# EAGLE design NGIMU Serial Breakout (EAGLE 7.5.0)
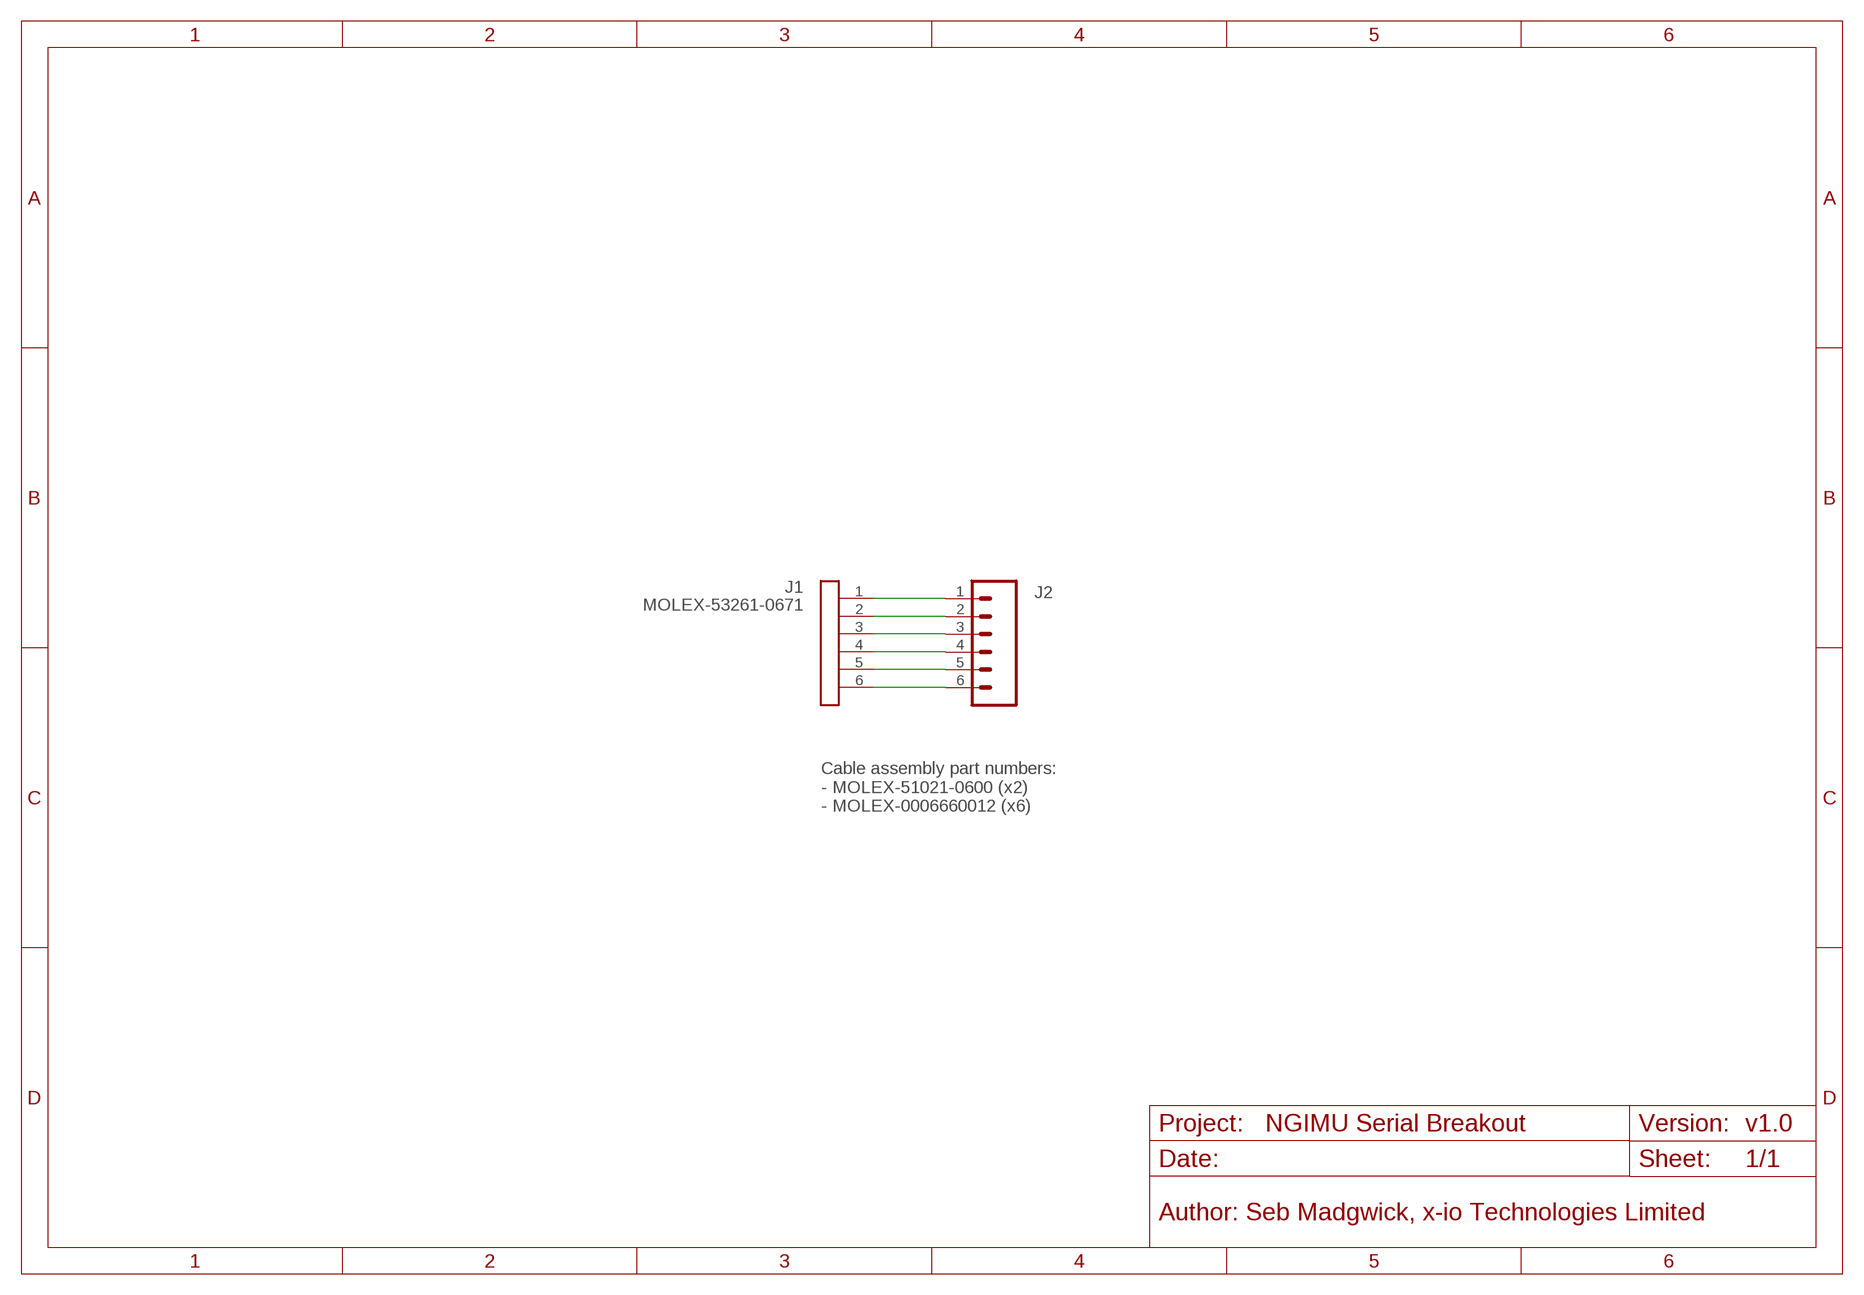
[diagram p0: schematic, sheet 1]

## Parts
J1  MOLEX-53261-0671  [MOLEX-53261-0671]
J2  M06NO_SILK_FEMALE_PTH  [1X06_NO_SILK]

## Nets
N$1: J1.6 J2.6
N$2: J1.5 J2.5
N$3: J1.4 J2.4
N$4: J1.3 J2.3
N$5: J1.2 J2.2
N$6: J1.1 J2.1

## Notes on the sheet
- Cable assembly part numbers:
  - MOLEX-51021-0600 (x2)
  - MOLEX-0006660012 (x6)
- v1.0
- Author: Seb Madgwick, x-io Technologies Limited

## Library data of the parts
J1 = x-io:MOLEX-53261-0671
J2 = SparkFun-Connectors:M06: Header 6 Standard 6-pin 0.1" header. Use with straight break away headers (SKU : PRT-00116), right angle break away headers (PRT-00553), swiss pins (PRT-00743), machine pins (PRT-00117), and female headers (PRT-00115). Molex polarized connector foot print use with SKU : PRT-08094 with associated crimp pins and housings. NOTES ON THE VARIANTS LOCK and LOCK_LONGPADS... This footprint was designed to help hold the alignment of a through-hole component (i.e. 6-pin header) while soldering it into place. You may notice that each hole has been shifted either up or down by 0.005 of an inch from it's more standard position (which is a perfectly straight line). This slight alteration caused the pins (the squares in the middle) to touch the edges of the holes. Because they are alternating, it causes a "brace" to hold the component in place. 0.005 has proven to be the perfect amount of "off-center" position when using our standard breakaway headers. Although looks a little odd when you look at the bare footprint, once you have a header in there, the alteration is very hard to notice. Also,if you push a header all the way into place, it is covered up entirely on the bottom side. This idea of altering the position of holes to aid alignment will be further integrated into the Sparkfun Library for other footprints. It can help hold any component with 3 or more connection pins.; PROD_ID: CONN-08437

## Board
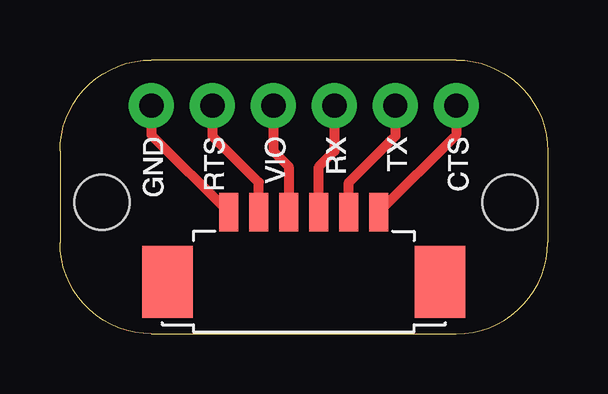
[diagram p1: board, top side]

Size 20.32 x 11.43 mm. Coordinates in mm from the lower left corner, seen from the top.
Outline: 3.81,0 16.51,0 arc90 20.32,3.81 20.32,7.62 arc90 16.51,11.43 3.81,11.43 arc90 0,7.62 0,3.81 arc90 3.81,0
Copper layers (1*16): Top 0.035mm / dielectric 1.5mm / Bottom 0.035mm
Design rules "default *": minimum track width 6mil, minimum drill 13mil, track to track 6mil, track to pad 6mil, pad to pad 6mil, via to via 6mil, smd to smd 6mil, copper to edge 15mil, drill to drill 13mil, minimum pad ring 10mil, minimum via ring 8mil, stop-mask expansion 4mil, vias tented up to drill 0mil, thermal gap 10mil
Holes 2.3 mm at 18.75,5.5 1.75,5.5

### Footprints (pad centres in the part's own frame; a part is rotated, then mirrored left to right if it is on the bottom)
MOLEX-53261-0671 = smd 0.8 x 1.6: 1 -3.125,0; 2 -1.875,0; 3 -0.625,0; 4 0.625,0; 5 1.875,0; 6 3.125,0 | smd 2.1 x 3: FITTING_NAIL1 -5.675,-2.9; FITTING_NAIL2 5.675,-2.9
1X06_NO_SILK = drill 1.016 pad 1.88: 1 0,0; 2 2.54,0; 3 5.08,0; 4 7.62,0; 5 10.16,0; 6 12.7,0

### Placement (x,y rotation side)
J1  10.16,5.08 0 top
J2  3.81,9.53 0 top
U$1  [NGIMU_SERIAL_BREAKOUT_V1.0_BOTTOM]  0,0 0 top
U$2  [NGIMU_SERIAL_BREAKOUT_V1.0_TOP]  0,0 0 top

### Tracks (layer width: path | path; a pad name or v marks a point on that pad's centre or on a via)
N$1
  Top 0.406: J2.6 16.51,8.3 J1.6
N$2
  Top 0.406: J2.5 13.97,8.26 12.04,6.32 J1.5
N$3
  Top 0.406: J2.4 11.43,7.62 10.79,6.97 J1.4
N$4
  Top 0.406: J2.3 8.89,7.62 9.53,6.99 9.53,5.09 J1.3
N$5
  Top 0.406: J2.2 6.35,8.26 8.29,6.32 J1.2
N$6
  Top 0.406: J2.1 3.81,8.3 J1.1

### Text on the board
tUnrenderedSilk: GND | RTS | VIO | RX | TX | CTS
bUnrenderedSilk: Ground | RTS-Out | Vin / Vout | RX-In | TX-Out | CTS-In | 2.3 mm | 17 mm